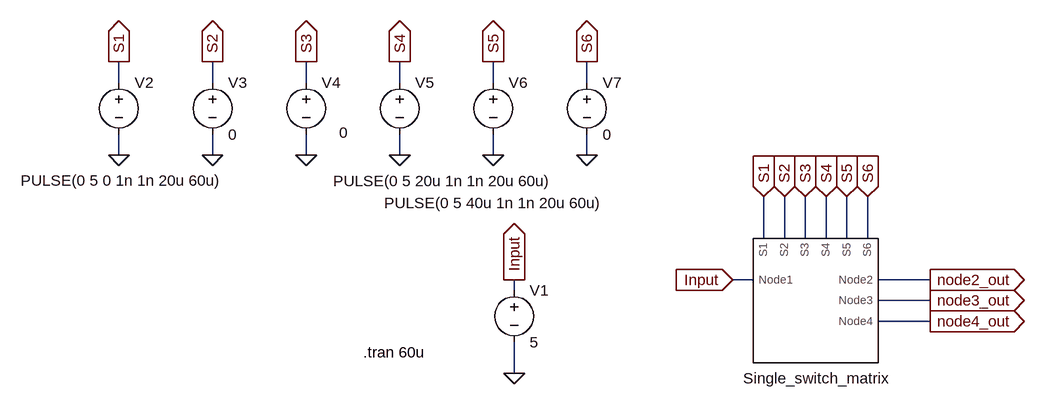
[diagram p0: schematic Switch_matrix_simulation.asc]
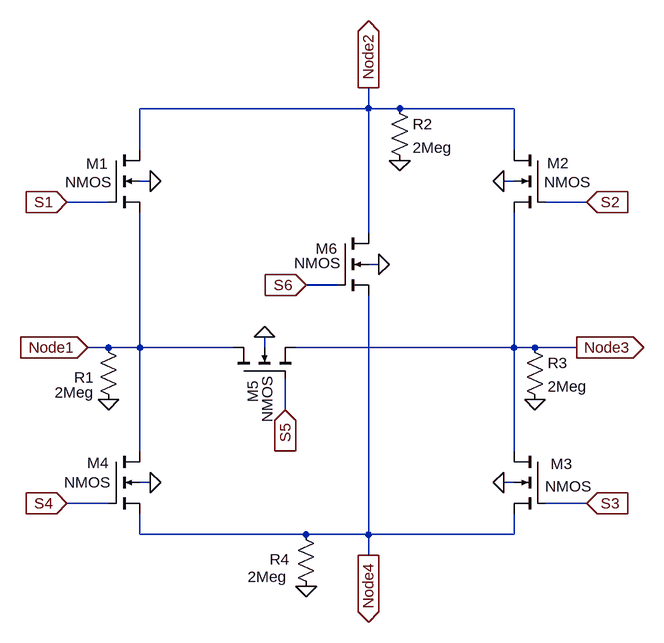
[diagram p1: sub-circuit switch_matrix.asc]
Switch_matrix_simulation.asc, the LTspice schematic file:
Version 4
SHEET 1 880 680
WIRE -720 -64 -720 -96
WIRE -576 -64 -576 -96
WIRE -432 -64 -432 -96
WIRE -288 -64 -288 -96
WIRE -144 -64 -144 -96
WIRE 0 -64 0 -96
WIRE -720 48 -720 16
WIRE -576 48 -576 16
WIRE -432 48 -432 16
WIRE -288 48 -288 16
WIRE -144 48 -144 16
WIRE 0 48 0 16
WIRE 272 176 272 112
WIRE 304 176 304 112
WIRE 336 176 336 112
WIRE 368 176 368 112
WIRE 400 176 400 112
WIRE 432 176 432 112
WIRE 256 240 224 240
WIRE 528 240 448 240
WIRE -112 256 -112 240
WIRE 528 272 448 272
WIRE 528 304 448 304
WIRE -112 384 -112 336
FLAG -112 384 0
FLAG -720 48 0
FLAG 528 272 node3_out
IOPIN 528 272 Out
FLAG 528 240 node2_out
IOPIN 528 240 Out
FLAG 528 304 node4_out
IOPIN 528 304 Out
FLAG 272 112 S1
IOPIN 272 112 In
FLAG 304 112 S2
IOPIN 304 112 In
FLAG 336 112 S3
IOPIN 336 112 In
FLAG 368 112 S4
IOPIN 368 112 In
FLAG 400 112 S5
IOPIN 400 112 In
FLAG 432 112 S6
IOPIN 432 112 In
FLAG -576 48 0
FLAG -432 48 0
FLAG -288 48 0
FLAG -144 48 0
FLAG 0 48 0
FLAG -720 -96 S1
IOPIN -720 -96 Out
FLAG -576 -96 S2
IOPIN -576 -96 Out
FLAG -432 -96 S3
IOPIN -432 -96 Out
FLAG -288 -96 S4
IOPIN -288 -96 Out
FLAG -144 -96 S5
IOPIN -144 -96 Out
FLAG 0 -96 S6
IOPIN 0 -96 Out
FLAG -112 240 Input
IOPIN -112 240 Out
FLAG 224 240 Input
IOPIN 224 240 In
SYMBOL voltage -112 240 R0
WINDOW 123 0 0 Left 0
WINDOW 39 0 0 Left 0
SYMATTR InstName V1
SYMATTR Value 5
SYMBOL voltage -720 -80 R0
WINDOW 123 0 0 Left 0
WINDOW 39 0 0 Left 0
WINDOW 3 -151 167 Left 2
SYMATTR Value PULSE(0 5 0 1n 1n 20u 60u)
SYMATTR InstName V2
SYMBOL Switch_matrix 432 336 R0
WINDOW 0 -78 40 Top 2
SYMATTR InstName Single_switch_matrix
SYMBOL voltage -576 -80 R0
WINDOW 123 0 0 Left 0
WINDOW 39 0 0 Left 0
SYMATTR InstName V3
SYMATTR Value 0
SYMBOL voltage -432 -80 R0
WINDOW 123 0 0 Left 0
WINDOW 39 0 0 Left 0
WINDOW 3 51 93 Left 2
SYMATTR Value 0
SYMATTR InstName V4
SYMBOL voltage -288 -80 R0
WINDOW 123 0 0 Left 0
WINDOW 39 0 0 Left 0
WINDOW 3 -24 202 Left 2
SYMATTR Value PULSE(0 5 40u 1n 1n 20u 60u)
SYMATTR InstName V5
SYMBOL voltage -144 -80 R0
WINDOW 123 0 0 Left 0
WINDOW 39 0 0 Left 0
WINDOW 3 -246 168 Left 2
SYMATTR Value PULSE(0 5 20u 1n 1n 20u 60u)
SYMATTR InstName V6
SYMBOL voltage 0 -80 R0
WINDOW 123 0 0 Left 0
WINDOW 39 0 0 Left 0
SYMATTR InstName V7
SYMATTR Value 0
TEXT -344 352 Left 2 !.tran 60u

switch_matrix.asc, the sub-circuit schematic file:
Version 4
SHEET 1 1160 836
WIRE 304 16 304 -16
WIRE 304 16 -48 16
WIRE 352 16 304 16
WIRE 528 16 352 16
WIRE -48 80 -48 16
WIRE 528 80 528 16
WIRE -32 128 -48 128
WIRE 528 128 512 128
WIRE -96 160 -160 160
WIRE 640 160 576 160
WIRE 304 208 304 16
WIRE 320 256 304 256
WIRE 256 288 208 288
WIRE -96 384 -128 384
WIRE -48 384 -48 176
WIRE -48 384 -96 384
WIRE 96 384 -48 384
WIRE 144 384 144 368
WIRE 528 384 528 176
WIRE 528 384 192 384
WIRE 560 384 528 384
WIRE 624 384 560 384
WIRE 176 480 176 432
WIRE -48 544 -48 384
WIRE 528 544 528 384
WIRE -32 592 -48 592
WIRE 528 592 512 592
WIRE -96 624 -160 624
WIRE 640 624 576 624
WIRE -48 672 -48 640
WIRE 208 672 -48 672
WIRE 304 672 304 304
WIRE 304 672 208 672
WIRE 528 672 528 640
WIRE 528 672 304 672
WIRE 304 704 304 672
FLAG -160 160 S1
IOPIN -160 160 In
FLAG 640 160 S2
IOPIN 640 160 In
FLAG 640 624 S3
IOPIN 640 624 In
FLAG -160 624 S4
IOPIN -160 624 In
FLAG 176 480 S5
IOPIN 176 480 In
FLAG 208 288 S6
IOPIN 208 288 In
FLAG -32 128 0
FLAG -32 592 0
FLAG 512 128 0
FLAG 512 592 0
FLAG 320 256 0
FLAG 144 368 0
FLAG -128 384 Node1
IOPIN -128 384 In
FLAG 304 704 Node4
IOPIN 304 704 Out
FLAG 624 384 Node3
IOPIN 624 384 Out
FLAG 304 -16 Node2
IOPIN 304 -16 Out
FLAG 352 96 0
FLAG 560 464 0
FLAG 208 752 0
FLAG -96 464 0
SYMBOL nmos4 -96 80 R0
WINDOW 0 -34 21 Left 2
WINDOW 3 -67 49 Left 2
SYMATTR InstName M1
SYMBOL nmos4 576 80 M0
WINDOW 0 -37 20 Left 2
WINDOW 3 -70 49 Left 2
SYMATTR InstName M2
SYMBOL nmos4 576 544 M0
WINDOW 0 -42 19 Left 2
WINDOW 3 -72 54 Left 2
SYMATTR InstName M3
SYMBOL nmos4 -96 544 R0
WINDOW 0 -33 18 Left 2
WINDOW 3 -68 48 Left 2
SYMATTR InstName M4
SYMBOL nmos4 96 432 R270
WINDOW 0 -37 30 Left 2
WINDOW 3 -68 52 Left 2
SYMATTR InstName M5
SYMBOL nmos4 256 208 R0
WINDOW 0 -33 24 Left 2
WINDOW 3 -66 46 Left 2
SYMATTR InstName M6
SYMBOL res -112 368 R0
WINDOW 0 -37 62 Left 2
WINDOW 3 -67 85 Left 2
SYMATTR InstName R1
SYMATTR Value 2Meg
SYMBOL res 336 0 R0
SYMATTR InstName R2
SYMATTR Value 2Meg
SYMBOL res 544 368 R0
SYMATTR InstName R3
SYMATTR Value 2Meg
SYMBOL res 192 656 R0
WINDOW 0 -40 54 Left 2
WINDOW 3 -74 81 Left 2
SYMATTR InstName R4
SYMATTR Value 2Meg

The netlist it stands for:
* Switch_matrix_simulation.asc
V1 Input 0 5
V2 S1 0 PULSE(0 5 0 1n 1n 20u 60u)
XSingle_switch_matrix Input S1 S2 S3 S4 S5 S6 node4_out node3_out node2_out switch_matrix
V3 S2 0 0
V4 S3 0 0
V5 S4 0 PULSE(0 5 40u 1n 1n 20u 60u)
V6 S5 0 PULSE(0 5 20u 1n 1n 20u 60u)
V7 S6 0 0

* block symbol definitions
.subckt switch_matrix Node1 S1 S2 S3 S4 S5 S6 Node4 Node3 Node2
M1 Node2 S1 Node1 0 NMOS
M2 Node2 S2 Node3 0 NMOS
M3 Node3 S3 Node4 0 NMOS
M4 Node1 S4 Node4 0 NMOS
M5 Node1 S5 Node3 0 NMOS
M6 Node2 S6 Node4 0 NMOS
R1 Node1 0 2Meg
R2 Node2 0 2Meg
R3 Node3 0 2Meg
R4 Node4 0 2Meg
.ends switch_matrix

.model NMOS NMOS
.model PMOS PMOS
.lib standard.mos
.tran 60u
.backanno
.end